# EAGLE schematic Pyranometer (EAGLE 7.7.0)
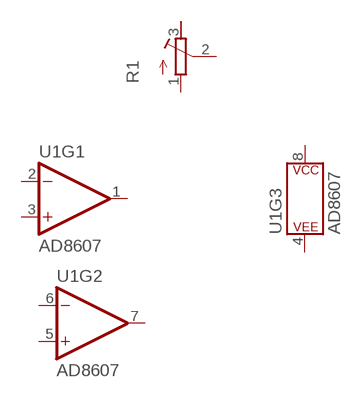
[diagram p0: schematic, sheet 1]

## Parts
R1  R-TRIMM3296Y  [RTRIM3296Y]
U1  AD8607  [SO08]
Unconnected: R1.1(A) R1.2(S) R1.3(E) U1.1(OUT) U1.2(-IN) U1.3(+IN) U1.4(P$V-) U1.5(+IN) U1.6(-IN) U1.7(OUT) U1.8(P$V+)

## Library data of the parts
R1 = resistor:R-TRIMM: Trimm resistor
U1 = SparkFun-IC-Amplifiers:AD8607: Micropower Low-noise Rail to Rail OP-AMP Datasheet SparkFun Products () Currently in prototype (unknown project); PROD_ID: IC-13133